# EAGLE design simaservo (EAGLE 9.5.2)
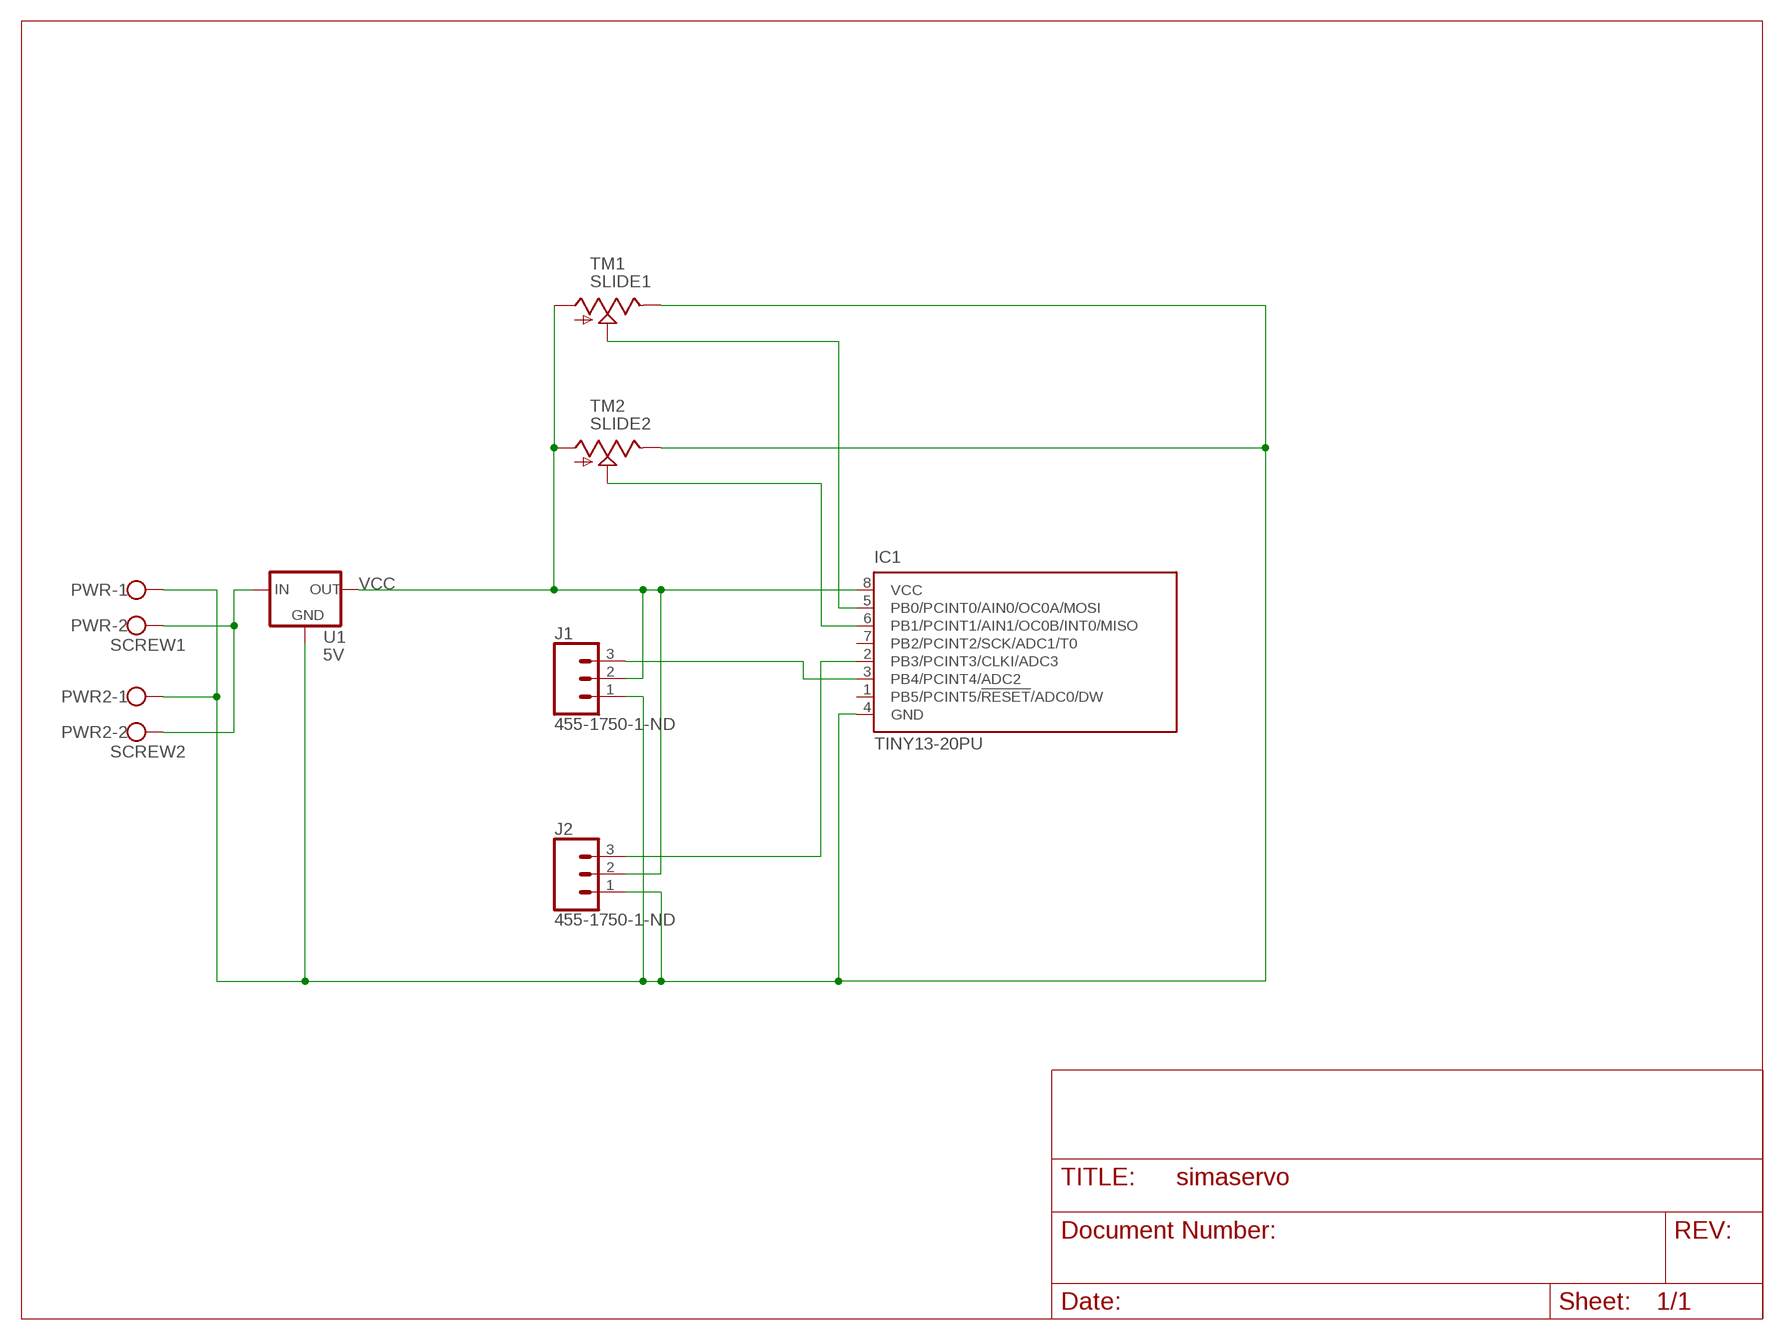
[diagram p0: schematic, sheet 1]

## Parts
IC1  TINY13-20PU  [DIL08]
J1  455-1750-1-ND  CONN_03  [1X03]
J2  455-1750-1-ND  CONN_03  [1X03]
PWR  SCREW1  W237-102  [W237-102]
PWR2  SCREW2  W237-102  [W237-102]
TM1  SLIDE1  TRIMSLIDE60  [SLIDEPOT-60]
TM2  SLIDE2  TRIMSLIDE60  [SLIDEPOT-60]
U1  5V  V_REG_78XXSINK  [TO220-IGO]

## Nets
AIN0: IC1.5(PB0/PCINT0/AIN0/OC0A/MOSI) TM1.WIPER
GND: IC1.4(GND) J1.1 J2.1 PWR2.1 PWR.1 TM1.B TM2.B U1.GND
N$4: IC1.6(PB1/PCINT1/AIN1/OC0B/INT0/MISO) TM2.WIPER
N$5: IC1.3(PB4/PCINT4/ADC2) J1.3
N$6: IC1.2(PB3/PCINT3/CLKI/ADC3) J2.3
VCC: IC1.8(VCC) J1.2 J2.2 TM1.A TM2.A U1.OUT
VIN: PWR2.2 PWR.2 U1.IN
Unconnected: IC1.1(PB5/PCINT5/!RESET!/ADC0/DW) IC1.7(PB2/PCINT2/SCK/ADC1/T0)

## Library data of the parts
IC1 = atmel:TINY13: 8-bit AVR Microcontroller with 1K Bytes In-System Programmable Flash Source: http://www.atmel.com/dyn/resources/prod_documents/2535S.pdf; MPN: ATTINY13-20PU; OC_FARNELL: 9171550; OC_NEWARK: 96K6521
J1 J2 = SparkFun-Connectors:CONN_03: Multi connection point. Often used as Generic Header-pin footprint for 0.1 inch spaced/style header connections On any of the 0.1 inch spaced packages, you can populate with these: Break Away Headers - Straight <https://www.sparkfun.com/products/116> (PRT-00116) Break Away Male Headers - Right Angle <https://www.sparkfun.com/products/553> (PRT-00553) Female Headers <https://www.sparkfun.com/products/115> (PRT-00115) Break Away Headers - Machine Pin <https://www.sparkfun.com/products/117> (PRT-00117) Break Away Female Headers - Swiss Machine Pin <https://www.sparkfun.com/products/743> (PRT-00743) Stackable Header - 3 Pin (Female, 0.1") <https://www.sparkfun.com/products/13875> (PRT-13875) For SCREWTERMINALS and SPRING TERMINALS visit here: Screw Terimnals on SparkFun.com <https://www.sparkfun.com/search/results?term=Screw+Terminals> (5mm/3.5mm/2.54mm spacing) This device is also useful as a general connection point to wire up your design to another part of your project. Our various solder wires solder well into these plated through hole pads. Hook-Up Wire - Assortment (Stranded, 22 AWG) <https://www.sparkfun.com/products/11375> (PRT-11375) Hook-Up Wire - Assortment (Solid Core, 22 AWG) <https://www.sparkfun.com/products/11367> (PRT-11367) View the entire wire category on our website here <https://www.sparkfun.com/categories/141> Special notes: Molex polarized connector foot print use with SKU : PRT-08232 with associated crimp pins and housings.; PROD_ID: XXX-00000
PWR PWR2 = con-wago-500:W237-102: WAGO SCREW CLAMP; MPN: 237-102; OC_FARNELL: unknown; OC_NEWARK: 70K9898
TM1 TM2 = Bourns PTA series:TRIM: Sliding potentiometers Based on Adafruits (https://github.com/adafruit/Adafruit-Eagle-Library) 'TRIM' device. For Bourns PTA series and TT Electronics PSxx series potentiometers.
U1 = SparkFun-IC-Power:V_REG_78XX: Voltage Regulator Standard 78xx regulator. IGO (Input Ground Output). Spark Fun Electronics SKU : COM-00107

## Board
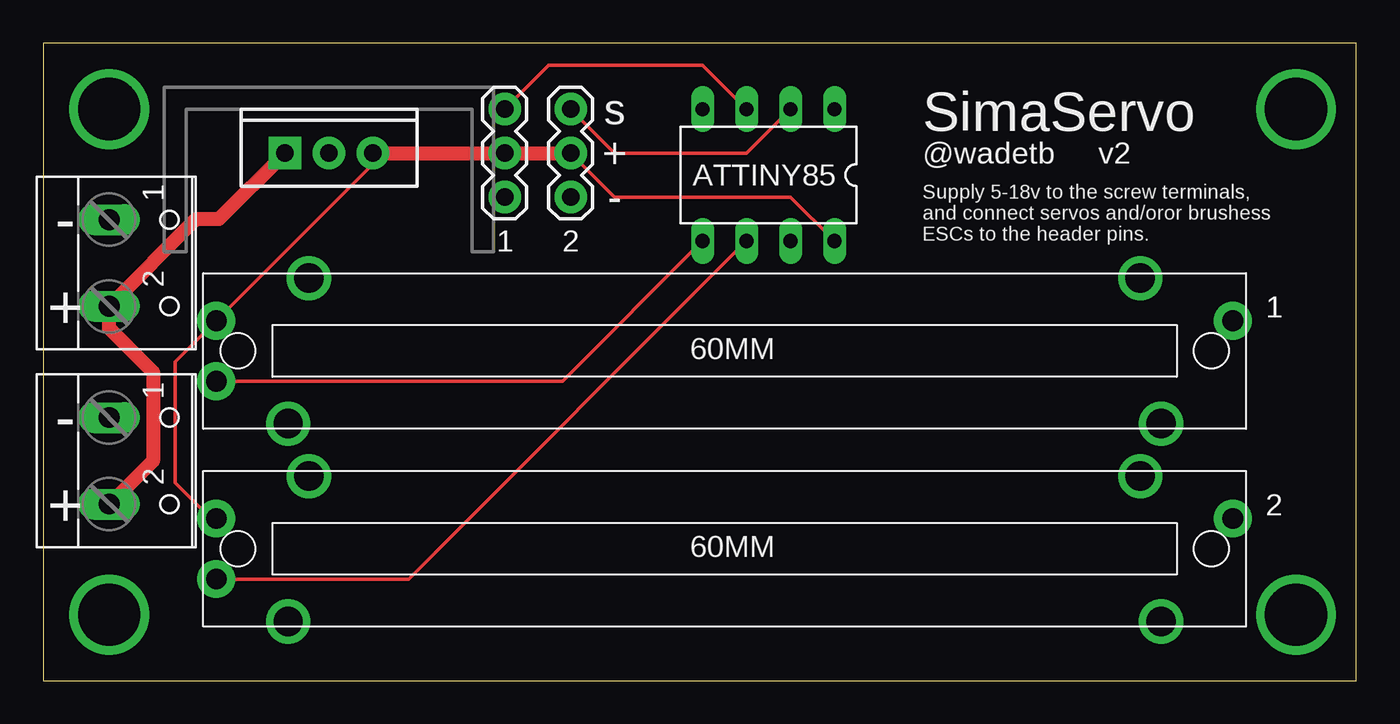
[diagram p1: board, top side]
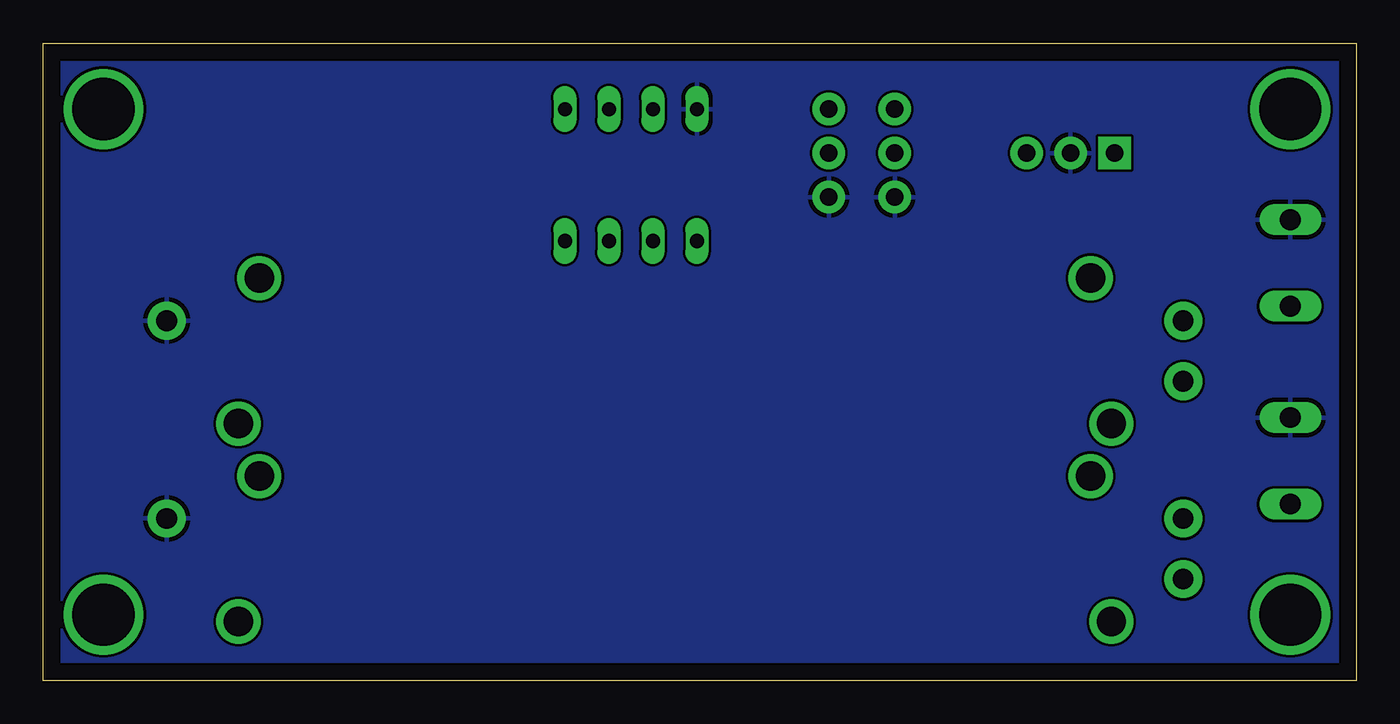
[diagram p2: board, bottom side, seen from below]

Size 75.87 x 36.82 mm. Coordinates in mm from the lower left corner, seen from the top.
Outline: 0,0 75.87,0 75.87,36.82 0,36.82 0,0
Copper layers (1*16): Top 0.035mm / dielectric 1.5mm / Bottom 0.035mm
Design rules "default": minimum track width 6mil, minimum drill 0.35mm, track to track 6mil, track to pad 6mil, pad to pad 6mil, via to via 6mil, smd to smd 6mil, copper to edge 40mil, drill to drill 6mil, minimum pad ring 10mil, minimum via ring 8mil, stop-mask expansion 4mil, vias tented up to drill 0mil, thermal gap 10mil

### Footprints (pad centres in the part's own frame; a part is rotated, then mirrored left to right if it is on the bottom)
DIL08 = drill 0.813 long: 1 -3.81,-3.81; 2 -1.27,-3.81; 3 1.27,-3.81; 4 3.81,-3.81; 5 3.81,3.81; 6 1.27,3.81; 7 -1.27,3.81; 8 -3.81,3.81
1X03 = drill 1.016 pad 1.88: 1 0,0; 2 2.54,0; 3 5.08,0
W237-102 = drill 1.194 long: 1 -2.5,-1.27; 2 2.5,-1.27
SLIDEPOT-60 = drill 1.2 pad 2.184: A -29.37,1.75; B 29.37,1.75; WIPER -29.37,-1.75 | drill 1.7 pad 2.54: P$1 -24.02,4.2; P$2 24.02,4.2; P$3 -25.22,-4.2; P$4 25.22,-4.2
TO220-IGO = drill 1 pad 1.88: GND 0,0; OUT 2.54,0 | drill 1 pad 1.88 square: IN -2.54,0

### Placement (x,y rotation side)
IC1  41.91,29.21 180 top
J1  26.67,27.94 90 top
J2  30.48,27.94 90 top
PWR  5.08,24.13 270 top
PWR2  5.08,12.7 270 top
TM1  39.37,19.05 0 top
TM2  39.37,7.62 0 top
U1  16.51,30.48 0 top

### Tracks (layer width: path | path; a pad name or v marks a point on that pad's centre or on a via)
AIN0
  Top 0.203: TM1.WIPER 30,17.3 IC1.5
GND
  pour Bottom: 0,36.83 76.2,36.83 76.2,0 0,0
N$1  (via drill 3.6 pad 1.2)
  other vias: 3.81,33.02
N$2  (via drill 3.6 pad 1.2)
  other vias: 3.81,3.81
N$3  (via drill 3.6 pad 1.2)
  other vias: 72.39,33.02
N$4
  Top 0.203: TM2.WIPER 21.11,5.87 IC1.6
N$5
  Top 0.203: IC1.3 38.1,35.56 29.21,35.56 J1.3
N$6
  Top 0.203: J2.3 33.02,30.48 40.64,30.48 IC1.2
N$7  (via drill 3.6 pad 1.2)
  other vias: 72.39,3.81
VCC
  Top 0.203: TM2.A 9.68,9.37 7.62,11.43 7.62,18.42 TM1.A 19.05,29.85 U1.OUT | J2.2 33.02,27.94 43.18,27.94 IC1.8
  Top 0.813: U1.OUT J1.2 J2.2
VIN
  Top 0.813: PWR2.2 3.85,10.2 6.35,12.7 6.35,17.82 3.81,20.36 PWR.2 8.85,26.67 10.16,26.67 U1.IN

### Text on the board
tPlace: s | SimaServo | + | @wadetb | v2 | ATTINY85 | - | - | 1 | 2 | Supply 5-18v to the screw terminals, / and connect servos and/oror brushess / ESCs to the header pins. | + | 1 | - | + | 2